# EAGLE design imu_3_yz (EAGLE 6.1)
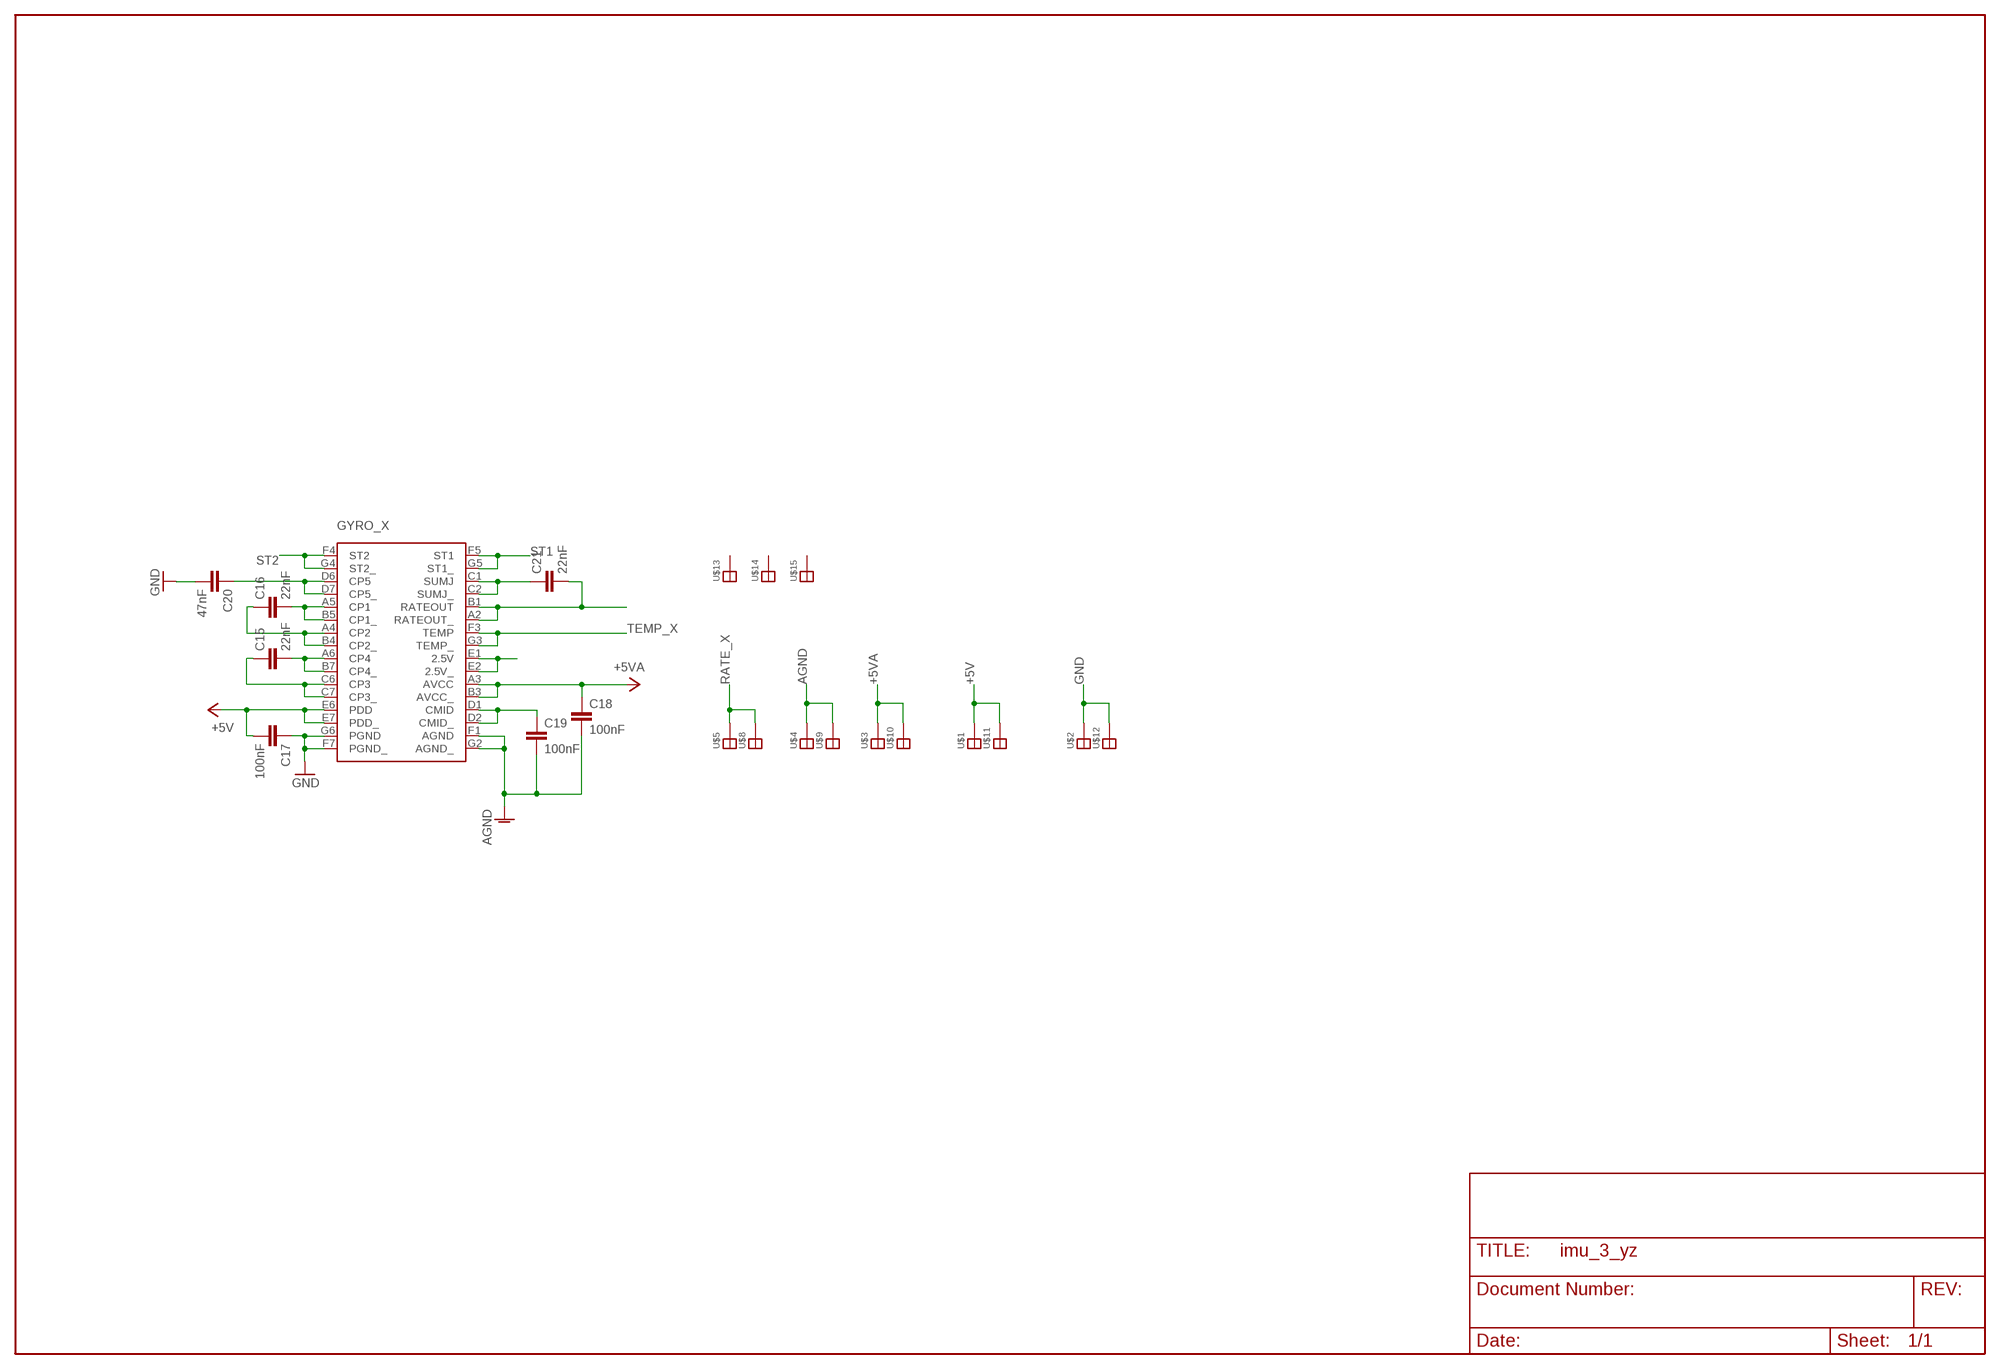
[diagram p0: schematic, sheet 1]

## Parts
C15  22nF  C-EUC0402K  [C0402K]
C16  22nF  C-EUC0402K  [C0402K]
C17  100nF  C-EUC0402K  [C0402K]
C18  100nF  C-EUC0402K  [C0402K]
C19  100nF  C-EUC0402K  [C0402K]
C20  47nF  C-EUC0402K  [C0402K]
C21  22nF  C-EUC0402K  [C0402K]
GYRO_X  ADXR  [BC-32]
U$1  SOLDER_PAD  [SOLDER_PAD]
U$2  SOLDER_PAD  [SOLDER_PAD]
U$3  SOLDER_PAD  [SOLDER_PAD]
U$4  SOLDER_PAD  [SOLDER_PAD]
U$5  SOLDER_PAD  [SOLDER_PAD]
U$8  SOLDER_PAD  [SOLDER_PAD]
U$9  SOLDER_PAD  [SOLDER_PAD]
U$10  SOLDER_PAD  [SOLDER_PAD]
U$11  SOLDER_PAD  [SOLDER_PAD]
U$12  SOLDER_PAD  [SOLDER_PAD]
U$13  SOLDER_PAD  [SOLDER_PAD]
U$14  SOLDER_PAD  [SOLDER_PAD]
U$15  SOLDER_PAD  [SOLDER_PAD]

## Nets
+5V: C17.2 GYRO_X.E6(PDD) GYRO_X.E7(PDD_) U$1.P$1 U$11.P$1
+5VA: C18.1 GYRO_X.A3(AVCC) GYRO_X.B3(AVCC_) U$3.P$1 U$10.P$1
AGND: C18.2 C19.2 GYRO_X.F1(AGND) GYRO_X.G2(AGND_) U$4.P$1 U$9.P$1
GND: C17.1 C20.2 GYRO_X.F7(PGND_) GYRO_X.G6(PGND) U$2.P$1 U$12.P$1
N$6: C21.1 GYRO_X.C1(SUMJ) GYRO_X.C2(SUMJ_)
N$7: C15.1 GYRO_X.C6(CP3) GYRO_X.C7(CP3_)
N$11: C20.1 GYRO_X.D6(CP5) GYRO_X.D7(CP5_)
N$12: C16.2 GYRO_X.A5(CP1) GYRO_X.B5(CP1_)
N$13: C16.1 GYRO_X.A4(CP2) GYRO_X.B4(CP2_)
N$14: C15.2 GYRO_X.A6(CP4) GYRO_X.B7(CP4_)
N$17: GYRO_X.E1(2.5V) GYRO_X.E2(2.5V_)
N$19: C19.1 GYRO_X.D1(CMID) GYRO_X.D2(CMID_)
RATE_X: C21.2 GYRO_X.A2(RATEOUT_) GYRO_X.B1(RATEOUT) U$5.P$1 U$8.P$1
ST1: GYRO_X.F5(ST1) GYRO_X.G5(ST1_)
ST2: GYRO_X.F4(ST2) GYRO_X.G4(ST2_)
TEMP_X: GYRO_X.F3(TEMP) GYRO_X.G3(TEMP_)
Unconnected: U$13.P$1 U$14.P$1 U$15.P$1

## Library data of the parts
C15-C21 = rcl:C-EU: CAPACITOR, European symbol
GYRO_X = paparazzi:ADXR
U$1-U$5 U$8-U$15 = paparazzi:SOLDER_PAD

## Board
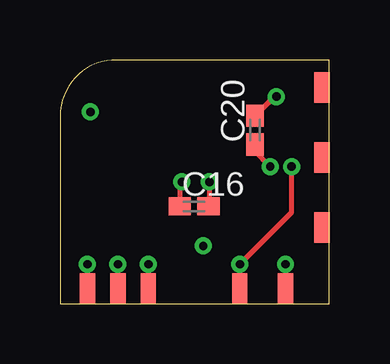
[diagram p1: board, top side]
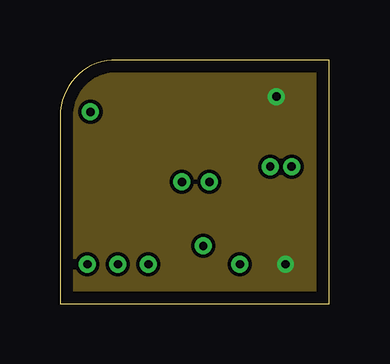
[diagram p2: board, inner layer Route2]
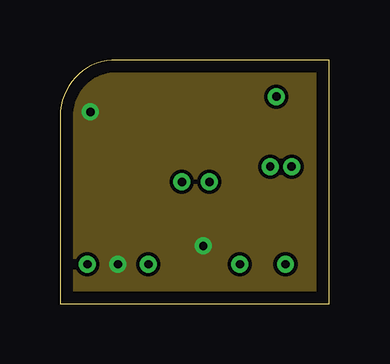
[diagram p3: board, inner layer Route15]
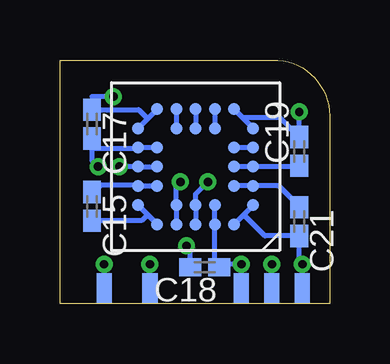
[diagram p4: board, bottom side, seen from below]

Size 11.23 x 10.16 mm. Coordinates in mm from the lower left corner, seen from the top.
Outline: 11.23,10.15 11.23,0 0.01,0 0.01,7.62 arc-90 2.16,10.16 11.21,10.16
Copper layers (1*2+15*16): Top 0.035mm / dielectric 0.2mm / Route2 0.035mm / dielectric 1.5mm / Route15 0.035mm / dielectric 0.2mm / Bottom 0.035mm
Design rules: minimum track width 0.15mm, minimum drill 0.35mm, track to track 0.15mm, track to pad 0.15mm, pad to pad 0.15mm, via to via 0.15mm, smd to smd 0.15mm, copper to edge 20mil, drill to drill 8mil, minimum pad ring 10mil, minimum via ring 7mil, stop-mask expansion 4mil, vias tented up to drill 0mil, thermal gap 10mil

### Footprints (pad centres in the part's own frame; a part is rotated, then mirrored left to right if it is on the bottom)
C0402K = smd 0.925 x 0.74: 1 -0.6,0; 2 0.6,0
BC-32 = smd 0.5 x 0.5: A2 -1.6,2.4; A3 -0.8,2.4; A4 0,2.4; A5 0.8,2.4; A6 1.6,2.4; B1 -2.4,1.6; B3 -0.8,1.6; B4 0,1.6; B5 0.8,1.6; B7 2.4,1.6; C1 -2.4,0.8; C2 -1.6,0.8; C6 1.6,0.8; C7 2.4,0.8; D1 -2.4,0; D2 -1.6,0; D6 1.6,0; D7 2.4,0; E1 -2.4,-0.8; E2 -1.6,-0.8; E6 1.6,-0.8; E7 2.4,-0.8; F1 -2.4,-1.6; F3 -0.8,-1.6; F4 0,-1.6; F5 0.8,-1.6; F7 2.4,-1.6; G2 -1.6,-2.4; G3 -0.8,-2.4; G4 0,-2.4; G5 0.8,-2.4; G6 1.6,-2.4
SOLDER_PAD = smd 0.635 x 1.27: P$1 0,0

### Placement (x,y rotation side)
C15  9.9,4.06 270 bottom
C16  5.59,4.06 0 top
C17  9.9,7.49 270 bottom
C18  5.21,1.52 180 bottom
C19  1.27,6.35 90 bottom
C20  8.13,7.24 90 top
C21  1.27,3.43 270 bottom
GYRO_X  5.59,5.72 180 bottom
U$1  7.49,0.64 180 top
U$2  9.4,0.64 180 top
U$3  3.68,0.64 180 top
U$4  2.41,0.64 180 top
U$5  1.14,0.64 180 top
U$8  1.14,0.64 0 bottom
U$9  2.41,0.64 0 bottom
U$10  3.68,0.64 0 bottom
U$11  7.49,0.64 0 bottom
U$12  9.4,0.64 0 bottom
U$13  10.92,9.02 0 top
U$14  10.92,6.1 0 top
U$15  10.92,3.17 0 top

### Tracks (layer width: path | path; a pad name or v marks a point on that pad's centre or on a via)
+5V  (via drill 0.35)
  Top 0.203: U$11.P$1 v7.49,1.65 9.65,3.81 v9.65,5.72
  Bottom 0.203: 7.99,6.49 8,6.48 9.9,6.48 | 7.99,6.49 GYRO_X.E7 | GYRO_X.E6 7.96,6.51 7.99,6.49 | U$11.P$1 v7.49,1.65 | v9.65,5.72 9.9,5.97 9.9,6.48 | 9.9,6.48 C17.2
+5VA  (via drill 0.35)
  Top 0.203: v3.68,1.65 U$10.P$1
  Bottom 0.203: U$10.P$1 v3.68,1.65 4.44,1.65 4.57,1.52 | 4.81,3.32 4.82,3.3 | 4.81,3.32 GYRO_X.A3 4.79,1.74 4.57,1.52 | GYRO_X.B3 4.79,3.34 4.81,3.32 | 4.57,1.52 C18.1
AGND  (via drill 0.35)
  Top 0.203: v2.41,1.65 U$9.P$1
  Bottom 0.203: GYRO_X.F1 3.17,7.33 3.17,7.37 3.24,7.37 3.59,7.72 | 3.59,7.72 GYRO_X.G2 | 3.59,7.72 3.55,7.75 2.07,7.75 C19.2 v1.27,8 | U$9.P$1 v2.41,1.65 | C18.2 5.81,2.25 v5.97,2.41
  pour Route15: 0,0 11.17,0 11.17,10.16 0,10.16
GND  (via drill 0.35)
  Top 0.203: v9.4,1.65 U$12.P$1 | C20.2 8.92,8.64 v9.02,8.64
  Bottom 0.203: GYRO_X.F7 8,7.33 8,7.37 7.94,7.37 7.59,7.72 | 7.59,7.72 GYRO_X.G6 | U$12.P$1 v9.4,1.65 | 7.59,7.72 7.96,8.09 C17.1 9.9,8.64 v9.02,8.64
  pour Route2: 11.17,10.16 0,10.16 0,0 11.17,0
N$6
  Bottom 0.203: GYRO_X.C1 GYRO_X.C2 | GYRO_X.C1 3.17,4.92 3.17,4.95 | C21.1 1.27,4.06 2.12,4.92 GYRO_X.C1
N$7
  Bottom 0.203: 7.99,4.94 8,4.95 | GYRO_X.C7 7.99,4.94 | GYRO_X.C6 7.96,4.92 7.99,4.94 | C15.1 9.9,4.57 9.54,4.94 7.99,4.94
N$11  (via drill 0.35)
  Top 0.203: C20.1 8.13,6.35 v8.76,5.72
  Bottom 0.203: GYRO_X.D6 GYRO_X.D7 v8.76,5.72
N$12  (via drill 0.35)
  Top 0.203: C16.2 6.22,4.1 v6.22,5.08
  Bottom 0.203: 6.36,3.32 6.35,3.3 | 6.36,3.32 GYRO_X.A5 | 6.36,3.32 6.39,3.34 GYRO_X.B5 6.39,4.92 v6.22,5.08
N$13  (via drill 0.35)
  Top 0.203: C16.1 4.99,4.99 v5.08,5.08
  Bottom 0.203: 5.59,3.3 GYRO_X.A4 GYRO_X.B4 5.59,4.57 v5.08,5.08
N$14
  Bottom 0.203: GYRO_X.B7 8,4.1 8,4.06 7.94,4.06 7.59,3.71 | 7.59,3.71 GYRO_X.A6 | C15.2 7.84,3.46 7.59,3.71
N$17
  Bottom 0.203: GYRO_X.E2 4.02,6.51 | 4.02,6.51 GYRO_X.E1 | 4.02,6.51 4.06,6.48
N$19
  Bottom 0.203: GYRO_X.D1 3.17,5.72 | GYRO_X.D1 GYRO_X.D2 | C19.1 1.27,5.72 GYRO_X.D1
RATE_X  (via drill 0.35)
  Top 0.203: v1.14,1.65 U$8.P$1
  Bottom 0.203: U$8.P$1 v1.14,1.65 1.27,1.78 C21.2 2.7,2.83 3.59,3.71 | GYRO_X.A2 3.97,3.3 3.94,3.3 3.94,3.37 3.59,3.71 | 3.59,3.71 GYRO_X.B1
ST1
  Bottom 0.203: 6.36,8.11 6.35,8.13 | GYRO_X.G5 6.36,8.11 | GYRO_X.F5 6.39,8.09 6.36,8.11
ST2
  Bottom 0.203: 5.59,8.13 GYRO_X.G4 GYRO_X.F4
TEMP_X
  Bottom 0.203: 4.81,8.11 4.82,8.13 | GYRO_X.G3 4.81,8.11 | GYRO_X.F3 4.79,8.09 4.81,8.11